# EAGLE design pulseHPT (EAGLE 9.6.2)
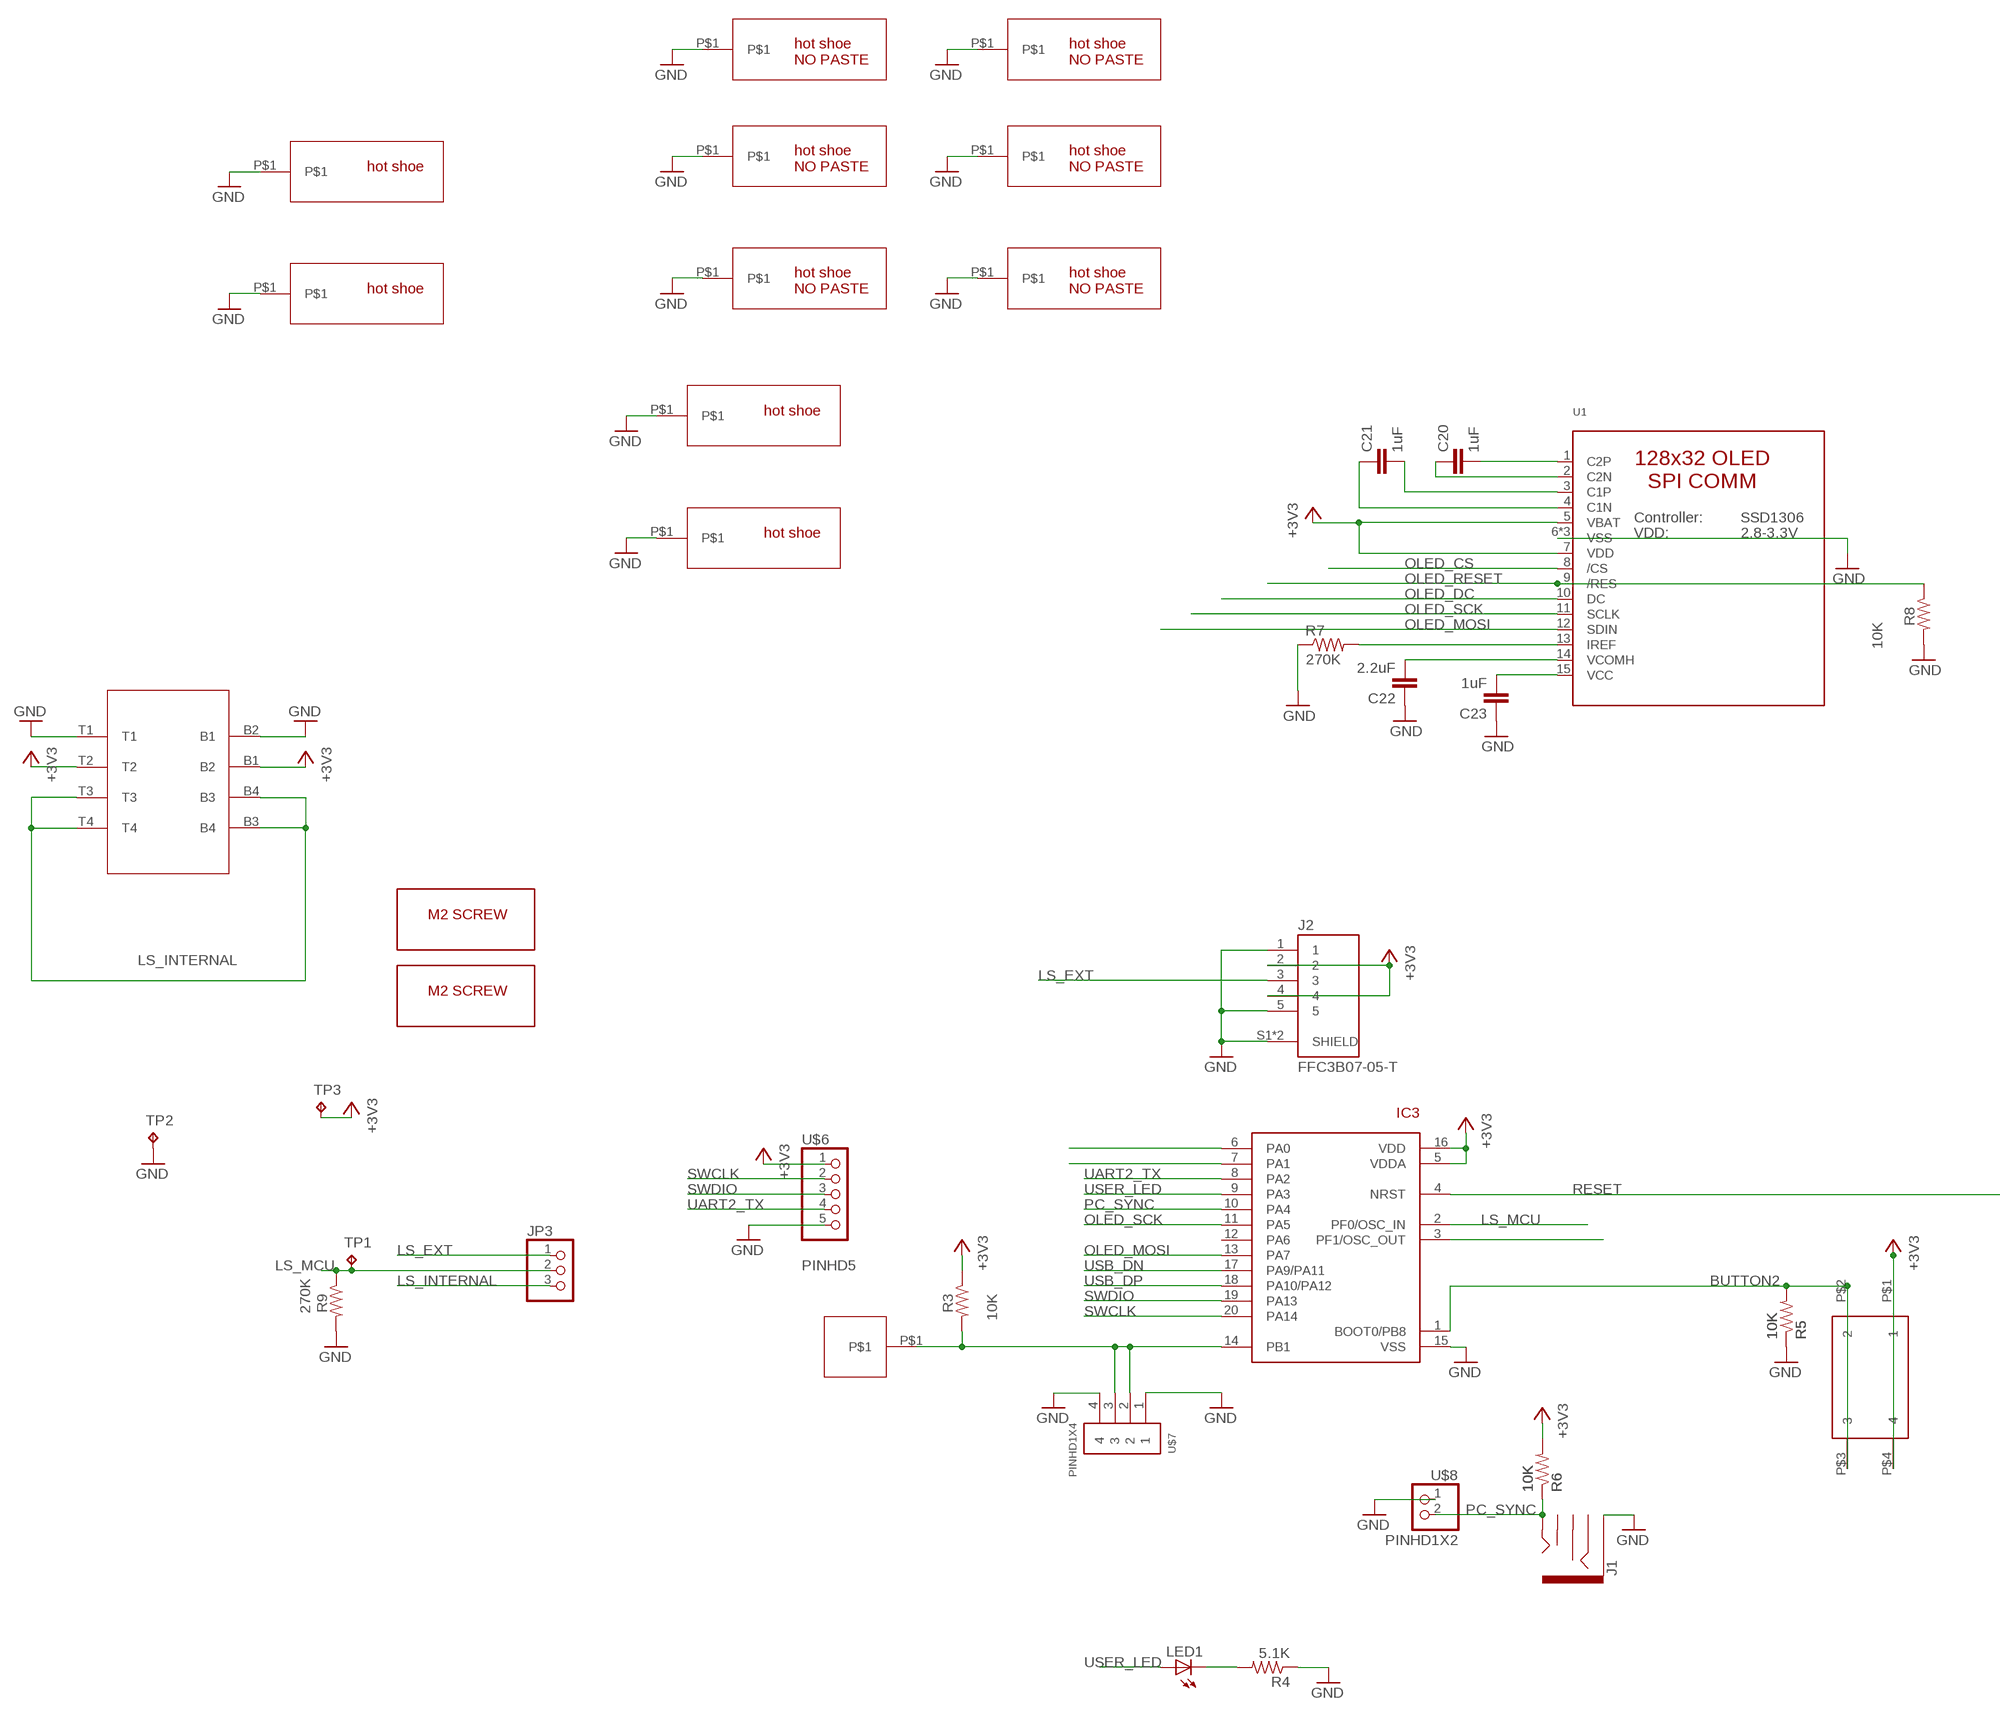
[diagram p0: schematic, sheet 1, part 1 of 2]
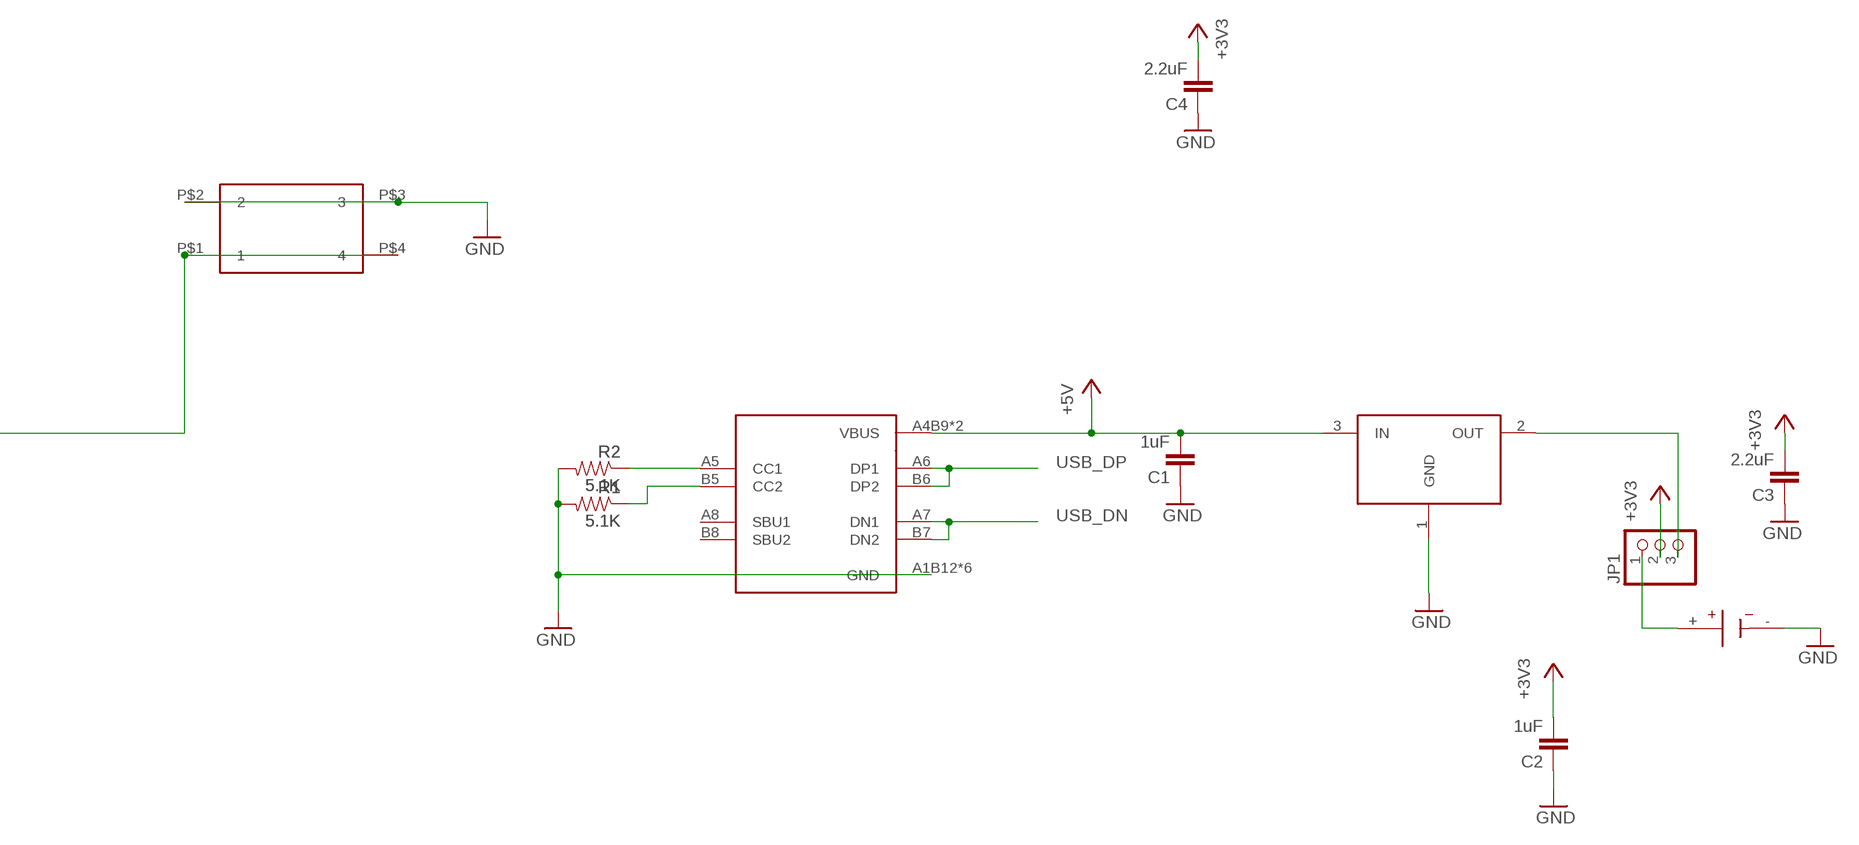
[diagram p1: schematic, sheet 1, part 2 of 2]

## Parts
BT1  BU2032SM-G  [BAT_BU2032SM-G]
C1  1uF  CAP0805  [0805]
C2  1uF  CAP0805  [0805]
C3  2.2uF  CAP0805  [0805]
C4  2.2uF  CAP0805  [0805]
C20  1uF  CAP0805  [0805]
C21  1uF  CAP0805  [0805]
C22  2.2uF  CAP0805  [0805]
C23  1uF  CAP0805  [0805]
IC3  STM32F042F4  [TSSOP20]
J1  AUDIO_JACK_3.5MM_PTH  [AUDIO-JACK]
J2  FFC3B07-05-T  [GCT_FFC3B07-05-T]
JP1  PINHD-1X3CB  [1X03-CLEANBIG]
JP3  PINHD-1X3CB  [1X03-CLEANBIG]
LED1  LEDCHIP-LED0805  [CHIP-LED0805]
R1  5.1K  RESISTOR0805-RES  [0805]
R2  5.1K  RESISTOR0805-RES  [0805]
R3  10K  RESISTOR0805-RES  [0805]
R4  5.1K  RESISTOR0805-RES  [0805]
R5  10K  RESISTOR0805-RES  [0805]
R6  10K  RESISTOR0805-RES  [0805]
R7  270K  RESISTOR0805-RES  [0805]
R8  10K  RESISTOR0805-RES  [0805]
R9  270K  RESISTOR0805-RES  [0805]
SW3  324_SW324_SWITCH_FOOT_HOLE  [342_SWICH_FOOT_HOLE]
SW4  324_SW  [342_SWICH_FOOT]
TP1  TPTP18R  [TP18R]
TP2  TPTP18R  [TP18R]
TP3  TPTP18R  [TP18R]
U1  LUL_DISP_OLED_UG-2864HSWEG01  [LUL_UG-2864HSWEG01_1.3_WRAPAROUND]
U2  USBC_16P  [USBC_16P_FOOT]
U4  XC6206_DEV  [SOT23R_INFINEON]
U$1  M2_SCREW_DEV  [M2_SCREW_FOOT]
U$2  SPRING_CONTACT  [SPRING_CONTACT]
U$3  HOTSHOE  [HOTSHOE_RAIL]
U$4  HOTSHOE  [HOTSHOE_RAIL]
U$5  HOTSHOE_NOPASTE  [HOTSHOE_RAIL_NOPASTE]
U$6  PINHD5  [1X05]
U$7  PINHD1X4  [1X04-CLEANBIG]
U$8  PINHD1X2  [1X02]
U$9  HOTSHOE_NOPASTE  [HOTSHOE_RAIL_NOPASTE]
U$10  HOTSHOE_NOPASTE  [HOTSHOE_RAIL_NOPASTE]
U$11  HOTSHOE_NOPASTE  [HOTSHOE_RAIL_NOPASTE]
U$12  M2_SCREW_DEV  [M2_SCREW_FOOT]
U$13  HOTSHOE_NOPASTE  [HOTSHOE_RAIL_NOPASTE]
U$14  HOTSHOE  [HOTSHOE_RAIL]
U$15  HOTSHOE_NOPASTE  [HOTSHOE_RAIL_NOPASTE]
U$16  HOTSHOE  [HOTSHOE_RAIL]
U$17  LS_HOLE  [LS]

## Nets
+3V3: C2.2 C3.2 C4.2 IC3.5(VDDA) IC3.16(VDD) J2.2 J2.4 JP1.2 R3.1 R6.2 SW4.P$1 SW4.P$4 TP3.TP U1.5(VBAT) U1.7(VDD) U$6.1 U$17.B1(B2) U$17.T2
+5V: C1.2 U2.A4B9(VBUS) U2.B4A9(VBUS) U4.3(IN)
BUTTON2: IC3.1(BOOT0/PB8) R5.2 SW4.P$2 SW4.P$3
GND: BT1.- C1.1 C2.1 C3.1 C4.1 C22.1 C23.1 IC3.15(VSS) J1.SLEEVE J2.1 J2.5 J2.S1(SHIELD) J2.S2(SHIELD) R1.2 R2.2 R4.1 R5.1 R7.1 R8.2 R9.2 SW3.P$2 SW3.P$3 TP2.TP U1.6(VSS) U1.16(VSS) U1.17(VSS) U2.A1B12(GND) U2.B11A12(GND) U2.P$13(GND) U2.P$14(GND) U2.P$15(GND) U2.P$16(GND) U4.1(GND) U$3.P$1 U$4.P$1 U$5.P$1 U$6.5 U$7.1 U$7.4 U$8.1 U$9.P$1 U$10.P$1 U$11.P$1 U$13.P$1 U$14.P$1 U$15.P$1 U$16.P$1 U$17.B2(B1) U$17.T1
LS_EXT: J2.3 JP3.1
LS_INTERNAL: JP3.3 U$17.B3(B4) U$17.B4(B3) U$17.T3 U$17.T4
LS_MCU: IC3.2(PF0/OSC_IN) JP3.2 R9.1 TP1.TP
N$2: IC3.14(PB1) R3.2 U$2.P$1 U$7.2 U$7.3
N$3: JP1.3 U4.2(OUT)
N$5: LED1.C R4.2
N$31: R1.1 U2.B5(CC2)
N$33: R2.1 U2.A5(CC1)
N$35: C20.2 U1.1(C2P)
N$36: C20.1 U1.2(C2N)
N$37: C21.2 U1.3(C1P)
N$38: C21.1 U1.4(C1N)
N$39: R7.2 U1.13(IREF)
N$40: C22.2 U1.14(VCOMH)
N$41: C23.2 U1.15(VCC)
OLED_CS: IC3.3(PF1/OSC_OUT) U1.8(/CS)
OLED_DC: IC3.7(PA1) U1.10(DC)
OLED_MOSI: IC3.13(PA7) U1.12(SDIN)
OLED_RESET: IC3.6(PA0) R8.1 U1.9(/RES)
OLED_SCK: IC3.11(PA5) U1.11(SCLK)
PC_SYNC: IC3.10(PA4) J1.TIP R6.1 U$8.2
RESET: IC3.4(NRST) SW3.P$1 SW3.P$4
SWCLK: IC3.20(PA14) U$6.2
SWDIO: IC3.19(PA13) U$6.3
UART2_TX: IC3.8(PA2) U$6.4
USB_DN: IC3.17(PA9/PA11) U2.A7(DN1) U2.B7(DN2)
USB_DP: IC3.18(PA10/PA12) U2.A6(DP1) U2.B6(DP2)
USER_LED: IC3.9(PA3) LED1.A
VBAT: BT1.+ JP1.1
Unconnected: IC3.12(PA6) J1.RING J1.RSH J1.TSH U2.A8(SBU1) U2.B8(SBU2)

## Library data of the parts
BT1 = BU2032SM-G:BU2032SM-G: Batt Holder Smt Coin 20mm Tape Check availability <https://pricing.snapeda.com/parts/BU2032SM-G/MPD/view-part?ref=eda>; AVAILABILITY: In Stock; CHECK_PRICES: https://www.snapeda.com/parts/BU2032SM-G/Memory+Protection+Devices/view-part/?ref=eda; DESCRIPTION: BATTERY HOLDER COIN 20MM SMD; MF: MPD; MP: BU2032SM-G; PACKAGE: None; PRICE: None; PURCHASE-URL: https://www.snapeda.com/api/url_track_click_mouser/?unipart_id=4219599&manufacturer=MPD&part_name=BU2032SM-G&search_term=battery holder; SNAPEDA_LINK: https://www.snapeda.com/parts/BU2032SM-G/Memory+Protection+Devices/view-part/?ref=snap
C1-C4 C20-C23 = clock:CAP: Capacitor Standard 0603 ceramic capacitor, and 0.1" leaded capacitor.
IC3 = tx:STM32F042F4
J1 = SparkFun-Connectors:AUDIO_JACK_3.5MM: Audio Jack 3.5mm variants of PTH and SMT stereo audio jack with bypass switches. SparkFun Products: SparkFun SparkPunk Sound Kit <[https://www.sparkfun.com/products/11177]> - PTH MP3 Trigger <https://www.sparkfun.com/products/13720> -3.5mm SMD SparkFun PicoBoard <https://www.sparkfun.com/products/11888>- 2.5mm SMD; PROD_ID: CONN-08774; SF_ID: PRT-08032
J2 = FFC3B07-05-T:FFC3B07-05-T: FPC 1.0mm Pitch, Side entry, Top contact, SMT, Height 2.5mm, Slide type Check availability <https://pricing.snapeda.com/parts/FFC3B07-05-T/Global%20Connector%20Technology/view-part?ref=eda>; AVAILABILITY: In Stock; CHECK_PRICES: https://www.snapeda.com/parts/FFC3B07-05-T/Global+Connector+Technology/view-part/?ref=eda; DESCRIPTION: 5 Position FFC, FPC Connector Contacts, Bottom 0.039 (1.00mm) Surface Mount, Right Angle; MF: Global Connector Technology; MP: FFC3B07-05-T; PACKAGE: None; PRICE: None; SNAPEDA_LINK: https://www.snapeda.com/parts/FFC3B07-05-T/Global+Connector+Technology/view-part/?ref=snap
JP1 JP3 = adafruit_changed:PINHD-1X3: PIN HEADER
LED1 = adafruit:LED: LED OSRAM: - CHIPLED LG R971, LG N971, LY N971, LG Q971, LY Q971, LO R971, LY R971 LH N974, LH R974 LS Q976, LO Q976, LY Q976 LO Q996 - Hyper CHIPLED LW Q18S LB Q993, LB Q99A, LB R99A - SideLED LS A670, LO A670, LY A670, LG A670, LP A670 LB A673, LV A673, LT A673, LW A673 LH A674 LY A675 LS A676, LA A676, LO A676, LY A676, LW A676 LS A679, LY A679, LG A679 - Hyper Micro SIDELED® LS Y876, LA Y876, LO Y876, LY Y876 LT Y87S - SmartLED LW L88C, LW L88S LB L89C, LB L89S, LG L890 LS L89K, LO L89K, LY L89K LS L896, LA L896, LO L896, LY L896 - TOPLED LS T670, LO T670, LY T670, LG T670, LP T670 LSG T670, LSP T670, LSY T670, LOP T670, LYG T670 LG T671, LOG T671, LSG T671 LB T673, LV T673, LT T673, LW T673 LH T674 LS T676, LA T676, LO T676, LY T676, LB T676, LH T676, LSB T676, LW T676 LB T67C, LV T67C, LT T67C, LS T67K, LO T67K, LY T67K, LW E67C LS E67B, LA E67B, LO E67B, LY E67B, LB E67C, LV E67C, LT E67C LW T67C LS T679, LY T679, LG T679 LS T770, LO T770, LY T770, LG T770, LP T770 LB T773, LV T773, LT T773, LW T773 LH T774 LS E675, LA E675, LY E675, LS T675 LS T776, LA T776, LO T776, LY T776, LB T776 LHGB T686 LT T68C, LB T68C - Hyper Mini TOPLED® LB M676 - Mini TOPLED Santana® LG M470 LS M47K, LO M47K, LY M47K Source: http://www.osram.convergy.de/
R1-R3 R5 R6 R8 R9 = joyAnalog:RESISTOR: Resistor Basic schematic elements and footprints for 0603, 1206, and PTH resistors.
R4 R7 = SparkFun-Passives:RESISTOR: Resistor Basic schematic elements and footprints for 0603, 1206, and PTH resistors.
SW3 = 3pos_slide_switch:324_SW
SW4 = 3pos_slide_switch_centered:324_SW
TP1-TP3 = testpad:TP: Test pad
U1 = lul:LUL_DISP_OLED_UG-2864HSWEG01: UG-2864HSWEG01 OLED display Both 1.3" and 0.96" models share the same FPC tab footprint, only the screen dimensions vary.
U2 = my_usbc_16p:USBC_16P
U4 = 3pos_slide_switch:XC6206_DEV
U$1 U$12 = 3pos_slide_switch_centered:M2_SCREW_DEV
U$2 = apricot:SPRING_CONTACT
U$3 U$4 U$14 U$16 = apricot:HOTSHOE
U$5 U$9-U$11 U$13 U$15 = apricot:HOTSHOE_NOPASTE
U$6 = adafruit_changed:PINHD5
U$7 = adafruit_changed:PINHD1X4
U$8 = adafruit_changed:PINHD1X2
U$17 = apricot:LS_HOLE

## Board
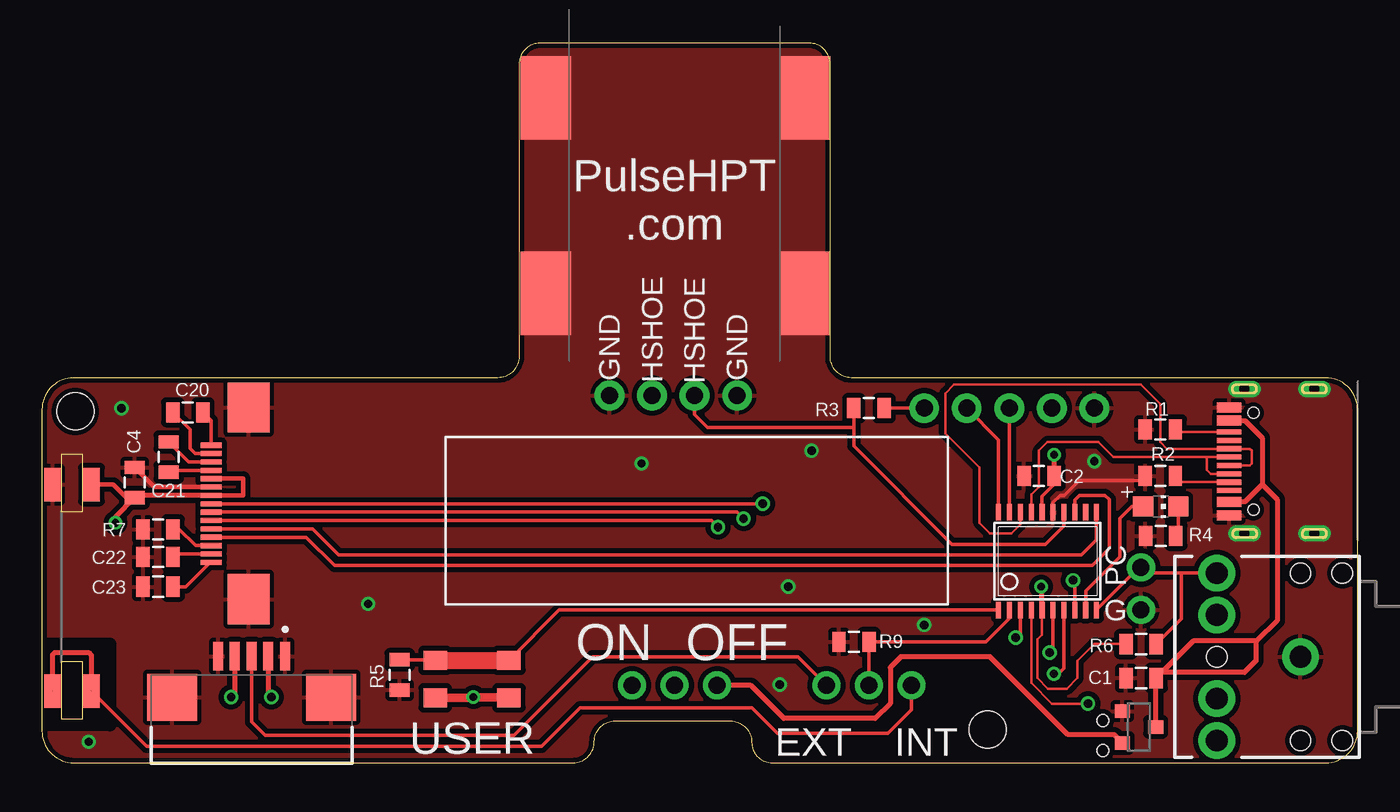
[diagram p2: board, top side]
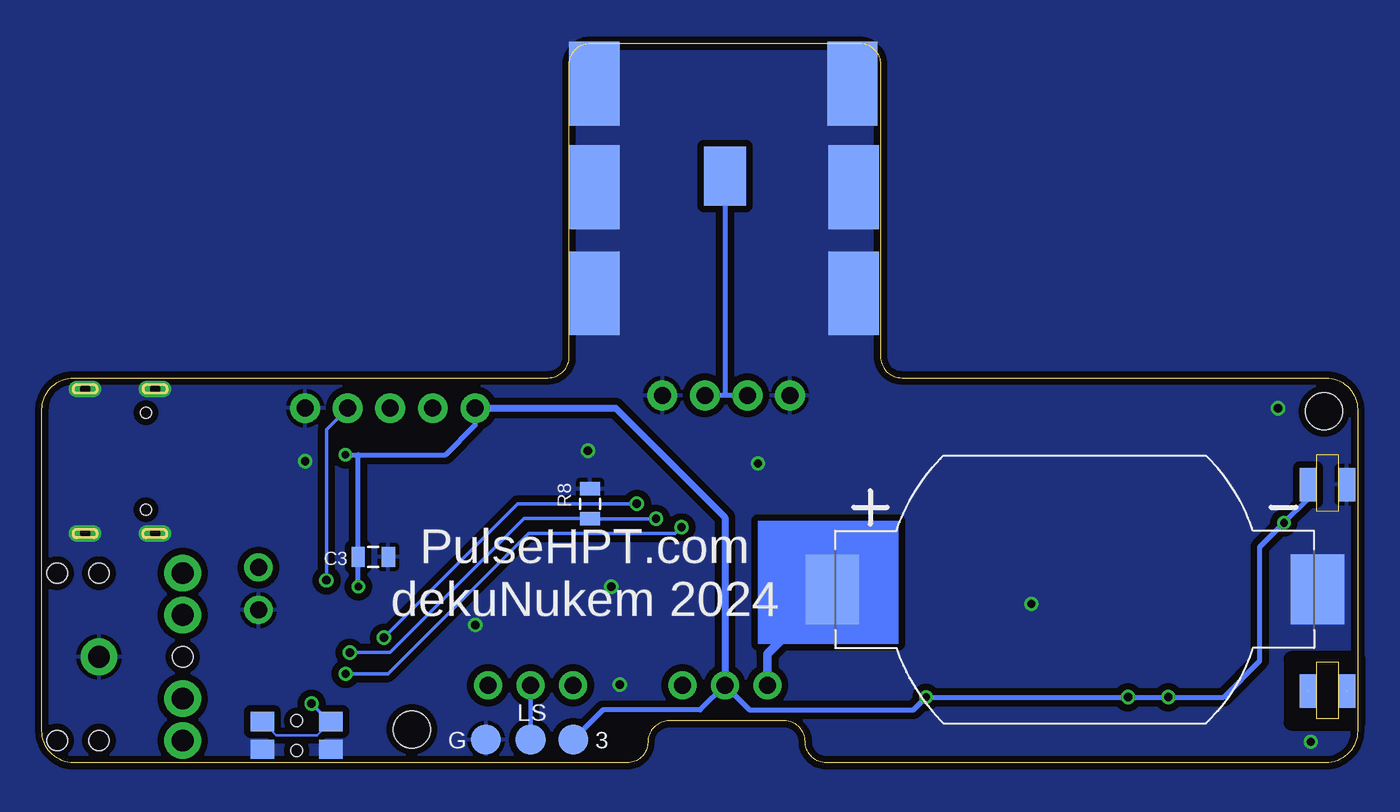
[diagram p3: board, bottom side, seen from below]

Size 78.6 x 43 mm. Coordinates in mm from the lower left corner, seen from the top.
Outline: 78.6,1.91 78.6,21.09 arc90 76.69,23 48.37,23 arc-90 47.1,24.27 47.1,41.73 arc90 45.83,43 29.77,43 arc90 28.5,41.73 28.5,24.27 arc-90 27.23,23 1.91,23 arc90 0,21.09 0,1.91 arc90 1.91,0 31.73,0 arc90 33,1.27 arc-90 34.23,2.5 41.13,2.5 arc-90 42.4,1.23 arc90 43.63,0 76.69,0 arc90 78.6,1.91
Copper layers (1*16): Top 0.035mm / dielectric 1.5mm / Bottom 0.035mm
Design rules "deku_2layer_6mil": minimum track width 6mil, minimum drill 15mil, track to track 6mil, track to pad 6mil, pad to pad 6mil, via to via 6mil, smd to smd 6mil, copper to edge 10mil, drill to drill 6mil, minimum pad ring 7mil, minimum via ring 7mil, stop-mask expansion 4mil, vias tented up to drill 25mil, thermal gap 10mil
tRestrict: area 0,2.3 to 4.1,7.1
bRestrict: area 0,2.4 to 3.9,6.2

### Footprints (pad centres in the part's own frame; a part is rotated, then mirrored left to right if it is on the bottom)
BAT_BU2032SM-G = smd 3.2 x 4.2: + -14.5,0; - 14.5,0
0805 = smd 0.8 x 1.2: 1 -0.9,0; 2 0.9,0
TSSOP20 = smd 0.305 x 0.991: 1 -2.925,-2.918; 2 -2.275,-2.918; 3 -1.625,-2.918; 4 -0.975,-2.918; 5 -0.325,-2.918; 6 0.325,-2.918; 7 0.975,-2.918; 8 1.625,-2.918; 9 2.275,-2.918; 10 2.925,-2.918; 11 2.925,2.918; 12 2.275,2.918; 13 1.625,2.918; 14 0.975,2.918; 15 0.325,2.918; 16 -0.325,2.918; 17 -0.975,2.918; 18 -1.625,2.918; 19 -2.275,2.918; 20 -2.925,2.918
AUDIO-JACK = drill 1.3 pad 2.184: RING 5,5; RSH 5,2.5; SLEEVE 0,0; TIP 5,-5; TSH 5,-2.5 | hole 1.2: 0,5; -2.5,5; -2.5,-5; 0,-5; 5,0
GCT_FFC3B07-05-T = smd 0.6 x 1.7: 1 2,2.45; 2 1,2.45; 3 0,2.45; 4 -1,2.45; 5 -2,2.45 | smd 3 x 2.8: S1 4.75,0; S2 -4.75,0
1X03-CLEANBIG = drill 1.016 pad 1.676: 1 -2.54,0; 2 0,0; 3 2.54,0
CHIP-LED0805 = smd 1.2 x 1.2: A 0,-1.05; C 0,1.05
342_SWICH_FOOT_HOLE = smd 1.4 x 1.15: P$1 -2.05,-0.825; P$2 -2.05,0.825; P$3 2.05,0.825; P$4 2.05,-0.825 | hole 0.7: 0,0.9; 0,-0.9
342_SWICH_FOOT = smd 1.4 x 1.15: P$1 -2.2,-1.125; P$2 -2.2,1.125; P$3 2.2,1.125; P$4 2.2,-1.125
TP18R = smd 1.8 x 1.8: TP 0,0
LUL_UG-2864HSWEG01_1.3_WRAPAROUND = smd 0.31 x 1.28: 1 3.5,0; 2 3,0; 3 2.5,0; 4 2,0; 5 1.5,0; 6 1,0; 7 0.5,0; 8 0,0; 9 -0.5,0; 10 -1,0; 11 -1.5,0; 12 -2,0; 13 -2.5,0; 14 -3,0; 15 -3.5,0 | smd 3 x 2.5: 16 5.75,-2.24; 17 -5.7,-2.24
USBC_16P_FOOT = smd 0.6 x 1.45: A1B12 -3.225,3.848; A4B9 -2.425,3.848; B4A9 2.425,3.848; B11A12 3.225,3.848 | smd 0.3 x 1.45: A5 -1.25,3.848; A6 -0.25,3.848; A7 0.25,3.848; A8 1.25,3.848; B5 1.75,3.848; B6 0.75,3.848; B7 -0.75,3.848; B8 -1.75,3.848 | drill 0.6 pad 1 long: P$13 -4.32,2.933; P$14 4.32,2.933; P$15 -4.32,-1.248; P$16 4.32,-1.248 | hole 0.65: -2.89,2.402; 2.89,2.402
SOT23R_INFINEON = smd 0.8 x 0.9: 1 -0.95,-1; 2 0.95,-1; 3 0,1
M2_SCREW_FOOT = hole 2.2: 0,0
SPRING_CONTACT = smd 2.5 x 3.5: P$1 0,0
HOTSHOE_RAIL = smd 3 x 5: P$1 0,0
HOTSHOE_RAIL_NOPASTE = smd 3 x 5: P$1 0,0
1X05 = drill 1.016 pad 1.778: 1 -6.35,0; 2 -3.81,0; 3 -1.27,0; 4 1.27,0; 5 3.81,0
1X04-CLEANBIG = drill 1.016 pad 1.778: 1 -3.81,0; 2 -1.27,0; 3 1.27,0; 4 3.81,0
1X02 = drill 1.016 pad 1.676: 1 -1.27,0; 2 1.27,0
LS = smd 1 x 2 bottom: B1 1.81,6.096; B2 -0.508,6.096; B3 1.81,-6.223; B4 -0.508,-6.223 | smd 1 x 2: T1 -0.508,6.096; T2 1.81,6.096; T3 -0.508,-6.223; T4 1.81,-6.223

### Placement (x,y rotation side)
BT1  16.9,10.36 0 bottom
C1  65.66,5.06 0 top
C2  59.57,17.13 0 top
C3  58.8,12.3 180 bottom
C4  5.54,16.74 270 top
C20  8.72,20.94 0 top
C21  7.58,18.27 90 top
C22  6.94,12.3 0 top
C23  6.94,10.52 0 top
IC3  60.08,12.05 0 top
J1  75.19,6.33 180 top
J2  12.53,3.92 0 top
JP1  37.8,4.63 0 top
JP3  49.41,4.63 0 top
LED1  66.83,15.31 270 top
R1  66.81,19.92 180 top
R2  66.81,17.13 180 top
R3  49.41,21.19 180 top
R4  66.83,13.57 0 top
R5  21.37,5.25 90 top
R6  65.66,7.09 180 top
R7  6.94,13.95 0 top
R8  45.85,15.47 90 bottom
R9  48.52,7.22 180 top
SW3  63.38,1.63 180 bottom
SW4  25.7,5 0 top
TP1  49.41,1.38 0 bottom
TP2  52.07,1.38 0 bottom
TP3  46.87,1.38 0 bottom
U1  10.12,15.47 90 top
U2  74.77,18.02 90 top
U4  65.54,2.14 270 top
U$1  56.5,2 0 top
U$2  37.8,35.05 0 bottom
U$3  30.1,39.73 0 top
U$4  45.6,39.73 0 top
U$5  30.1,28.05 0 bottom
U$6  59.06,21.19 0 top
U$7  37.72,21.95 0 top
U$8  65.66,10.39 90 top
U$9  45.6,28.05 0 bottom
U$10  45.6,40.58 0 bottom
U$11  30.1,34.4 0 bottom
U$12  2,21 0 top
U$13  45.6,34.4 0 bottom
U$14  30.1,28.05 0 top
U$15  30.17,40.58 0 bottom
U$16  45.6,28.05 0 top
U$17  1.15,10.52 0 top

### Tracks (layer width: path | path; a pad name or v marks a point on that pad's centre or on a via)
+3V3  (via drill 0.45, 0.5)
  Top 0.152: IC3.5 59.75,7.66 59.47,7.37 59.47,5.06 60.1,4.43 61.22,4.43 61.85,5.06 61.85,6.08 62.87,7.09 R6.2
  Top 0.203: IC3.16 59.75,15.91 60.47,16.63 C2.2 | R3.1 U$6.1
  Top 0.254: U1.7 12.02,15.97 12.02,16.98 U1.5 | C4.2 5.04,15.85 4.26,16.62 U$17.T2
  Top 0.305: v60.46,18.4 60.47,18.38 C2.2 | J2.4 11.53,4.14 v11.31,3.92 | J2.2 13.53,4.11 v13.72,3.92 | U1.7 5.67,15.97 C4.2 4.4,14.7 v4.4,14.33 | IC3.5 59.75,10.47 v59.69,10.52
  Top 0.508: SW4.P$1 25.74,3.88 v25.79,3.92 27.86,3.92 SW4.P$4
  Bottom 0.305: v60.46,18.4 59.69,18.4 | 59.69,18.4 54.49,18.4 52.71,20.17 U$6.1 | v59.69,10.52 59.69,12.29 C3.2 59.7,18.38 59.69,18.4 | TP3.TP 45.09,3.16 39.27,3.16 JP1.2 36.33,3.16 26.55,3.16 v25.79,3.92 v13.72,3.92 v11.31,3.92 8,3.92 5.85,6.08 5.85,12.89 v4.4,14.33 2.96,15.78 U$17.T2
  Bottom 0.406: U$6.1 44.33,21.19 37.8,14.66 JP1.2
+5V
  Top 0.305: U2.B4A9 71.87,20.44 72.9,19.41 72.9,16.62 | U2.A4B9 71.87,15.59 72.9,16.62 | 72.9,16.62 73.79,15.73 73.79,8.49 72.57,7.27 | C1.2 68.77,7.27 72.57,7.27 | 72.57,7.27 72.52,7.22 72.52,6.08 71.84,5.39 66.89,5.39 C1.2 | U4.3 66.54,5.03 C1.2
BUTTON2
  Top 0.203: R5.2 23.47,6.15 SW4.P$2 | SW4.P$3 30.9,9.13 IC3.1
  Top 1.016: SW4.P$2 SW4.P$3
GND  (via drill 0.5)
  Top 0.203: R2.2 65.65,16.87 61.98,16.87 61.09,15.98 60.84,15.98 60.4,15.55 IC3.15
  Top 0.254: U1.6 6.7,16.48 C4.1
  other vias: 35.82,17.89 44.58,10.52 4.76,21.18 62.87,18.02 52.71,8.24 44.07,4.68 45.98,18.65 19.49,9.5 2.8,1.25
  pour Top (isolate 0.305): -6.35,55 -6.35,-13 86.14,-13 86.14,55
  pour Bottom (isolate 0.406): -4.5,50 83.5,50 83.5,-9 -4.5,-9
LS_EXT
  Top 0.203: J2.3 12.53,2.44 13.34,1.63 28.2,1.63 32.9,6.33 45.16,6.33 JP3.1
LS_INTERNAL  (2 unrouted)
  Top 0.203: JP3.3 51.95,3.16 50.55,1.76 43.95,1.76 42.42,3.28 32.13,3.28 29.85,1 6.26,1 U$17.B3
  Top 0.305: U$17.B4 0.64,6.46 0.77,6.59 2.8,6.59 2.96,6.43 U$17.B3
LS_MCU
  Top 0.203: JP3.2 49.41,7.21 R9.1 56.39,7.22 57.8,8.63 IC3.2
  Bottom 0.254: TP1.TP JP3.2
N$2
  Top 0.203: IC3.14 61.05,14.16 59.95,13.06 54.36,13.06 48.51,18.91 48.51,20.05 | R3.2 48.51,20.05 | U$7.3 38.99,20.81 39.76,20.05 48.51,20.05
  Bottom 0.305: U$7.2 37.85,21.95 | 37.85,21.95 U$7.3 | 37.85,21.95 37.8,22 U$2.P$1
N$3
  Top 0.305: U4.2 64.05,1.67 61.3,1.67 56.65,6.33 51.31,6.33 50.68,5.7 50.68,3.54 49.79,2.65 44.33,2.65 42.35,4.63 JP1.3
N$5
  Top 0.203: LED1.C 67.88,13.72 R4.2
N$31
  Top 0.152: U2.B5 67.86,19.77 R1.1
N$33
  Top 0.152: R2.1 68.07,16.77 U2.A5
N$35
  Top 0.203: C20.2 10.12,20.44 U1.1
N$36
  Top 0.203: C20.1 8.85,19.91 8.85,18.78 9.15,18.48 U1.2
N$37
  Top 0.203: U1.3 8.76,17.98 7.58,19.16 C21.2
N$38
  Top 0.203: C21.1 7.68,17.48 U1.4
N$39
  Top 0.203: U1.13 9.19,12.97 8.21,13.95 R7.2
N$40
  Top 0.203: U1.14 8.02,12.47 C22.2
N$41
  Top 0.203: U1.15 10.05,11.97 8.59,10.52 C23.2
OLED_CS  (via drill 0.5)
  Top 0.203: U1.8 v43.06,15.47 | v58.17,7.47 58.45,7.75 IC3.3
  Bottom 0.203: v43.06,15.47 50.17,15.47 v58.17,7.47
OLED_DC  (via drill 0.5)
  Top 0.203: U1.10 39.99,14.47 v40.39,14.08 | v60.46,5.32 60.71,5.32 61.05,5.66 IC3.7
  Bottom 0.203: v40.39,14.08 40.77,13.7 49.53,13.7 57.92,5.32 v60.46,5.32
OLED_MOSI
  Top 0.203: IC3.13 61.7,15.7 61.98,15.98 63.5,15.98 63.76,15.73 63.76,12.81 62.74,11.79 17.48,11.79 15.8,13.47 U1.12
OLED_RESET  (via drill 0.5)
  Top 0.203: U1.9 41.52,14.97 v41.91,14.59 | v60.2,6.59 60.4,6.78 IC3.6
  Bottom 0.203: v60.2,6.59 57.79,6.59 49.79,14.59 45.86,14.59 R8.1 41.92,14.57 v41.91,14.59
OLED_SCK
  Top 0.203: IC3.11 63,13.32 62.11,12.43 17.74,12.43 16.19,13.97 U1.11
PC_SYNC
  Top 0.203: J1.TIP 68.08,11.33 | 68.08,11.33 66,11.33 U$8.2 65.54,11.66 IC3.10 | R6.1 68.08,8.61 68.08,11.33
RESET  (via drill 0.5)
  Top 0.152: IC3.4 59.1,4.77 60.33,3.54 v62.49,3.54
  Bottom 0.152: 61.41,2.46 61.34,2.46 | 61.34,2.46 SW3.P$1 | SW3.P$4 64.6,1.63 62.17,1.63 61.34,2.46
  Bottom 0.203: v62.49,3.54 61.41,2.46 SW3.P$1
SWCLK
  Top 0.203: IC3.20 57.15,19.29 U$6.2
SWDIO
  Top 0.203: U$6.3 57.8,21.18 IC3.19
UART2_TX  (via drill 0.5)
  Top 0.203: IC3.8 61.7,10.8 v61.6,10.9
  Bottom 0.203: v61.6,10.9 61.6,19.92 U$6.4
USB_DN
  Top 0.152: U2.A7 69.6,18.27 | U2.B7 69.84,17.27 69.6,17.51 69.6,18.27 | IC3.17 59.1,16.02 59.57,16.49 59.57,18.65 60.08,19.16 63.12,19.16 64.02,18.27 69.6,18.27
USB_DP
  Top 0.152: U2.A6 72.14,17.77 72.27,17.89 72.27,18.65 72.15,18.77 U2.B6 67.2,18.77 66.81,19.16 66.81,21.44 65.66,22.59 54.49,22.59 53.98,22.08 53.98,19.67 56.01,17.63 56.01,14.33 56.65,13.7 57.92,13.7 58.45,14.23 IC3.18
USER_LED
  Top 0.203: IC3.9 62.35,10.26 64.39,12.3 64.39,14.59 65.12,15.31 LED1.A
VBAT
  Bottom 0.508: BT1.+ 35.26,6.5 JP1.1
(copper drawn outside any net)
  shapes: Bottom area x1

### Text on the board
tNames: 1.2mm Thick / ENIG gold finish / FDX0039B2 Spring contact | PulseHPT / .com | HSHOE | HSHOE | GND | GND | PC | G | ON | OFF | USER | EXT | INT
bNames: PulseHPT.com / dekuNukem 2024 | LS | 3 | G
tDocu: CLK | DIO | TX | G | 3V3